# EAGLE schematic Payload_Electronics (EAGLE 9.0.1)
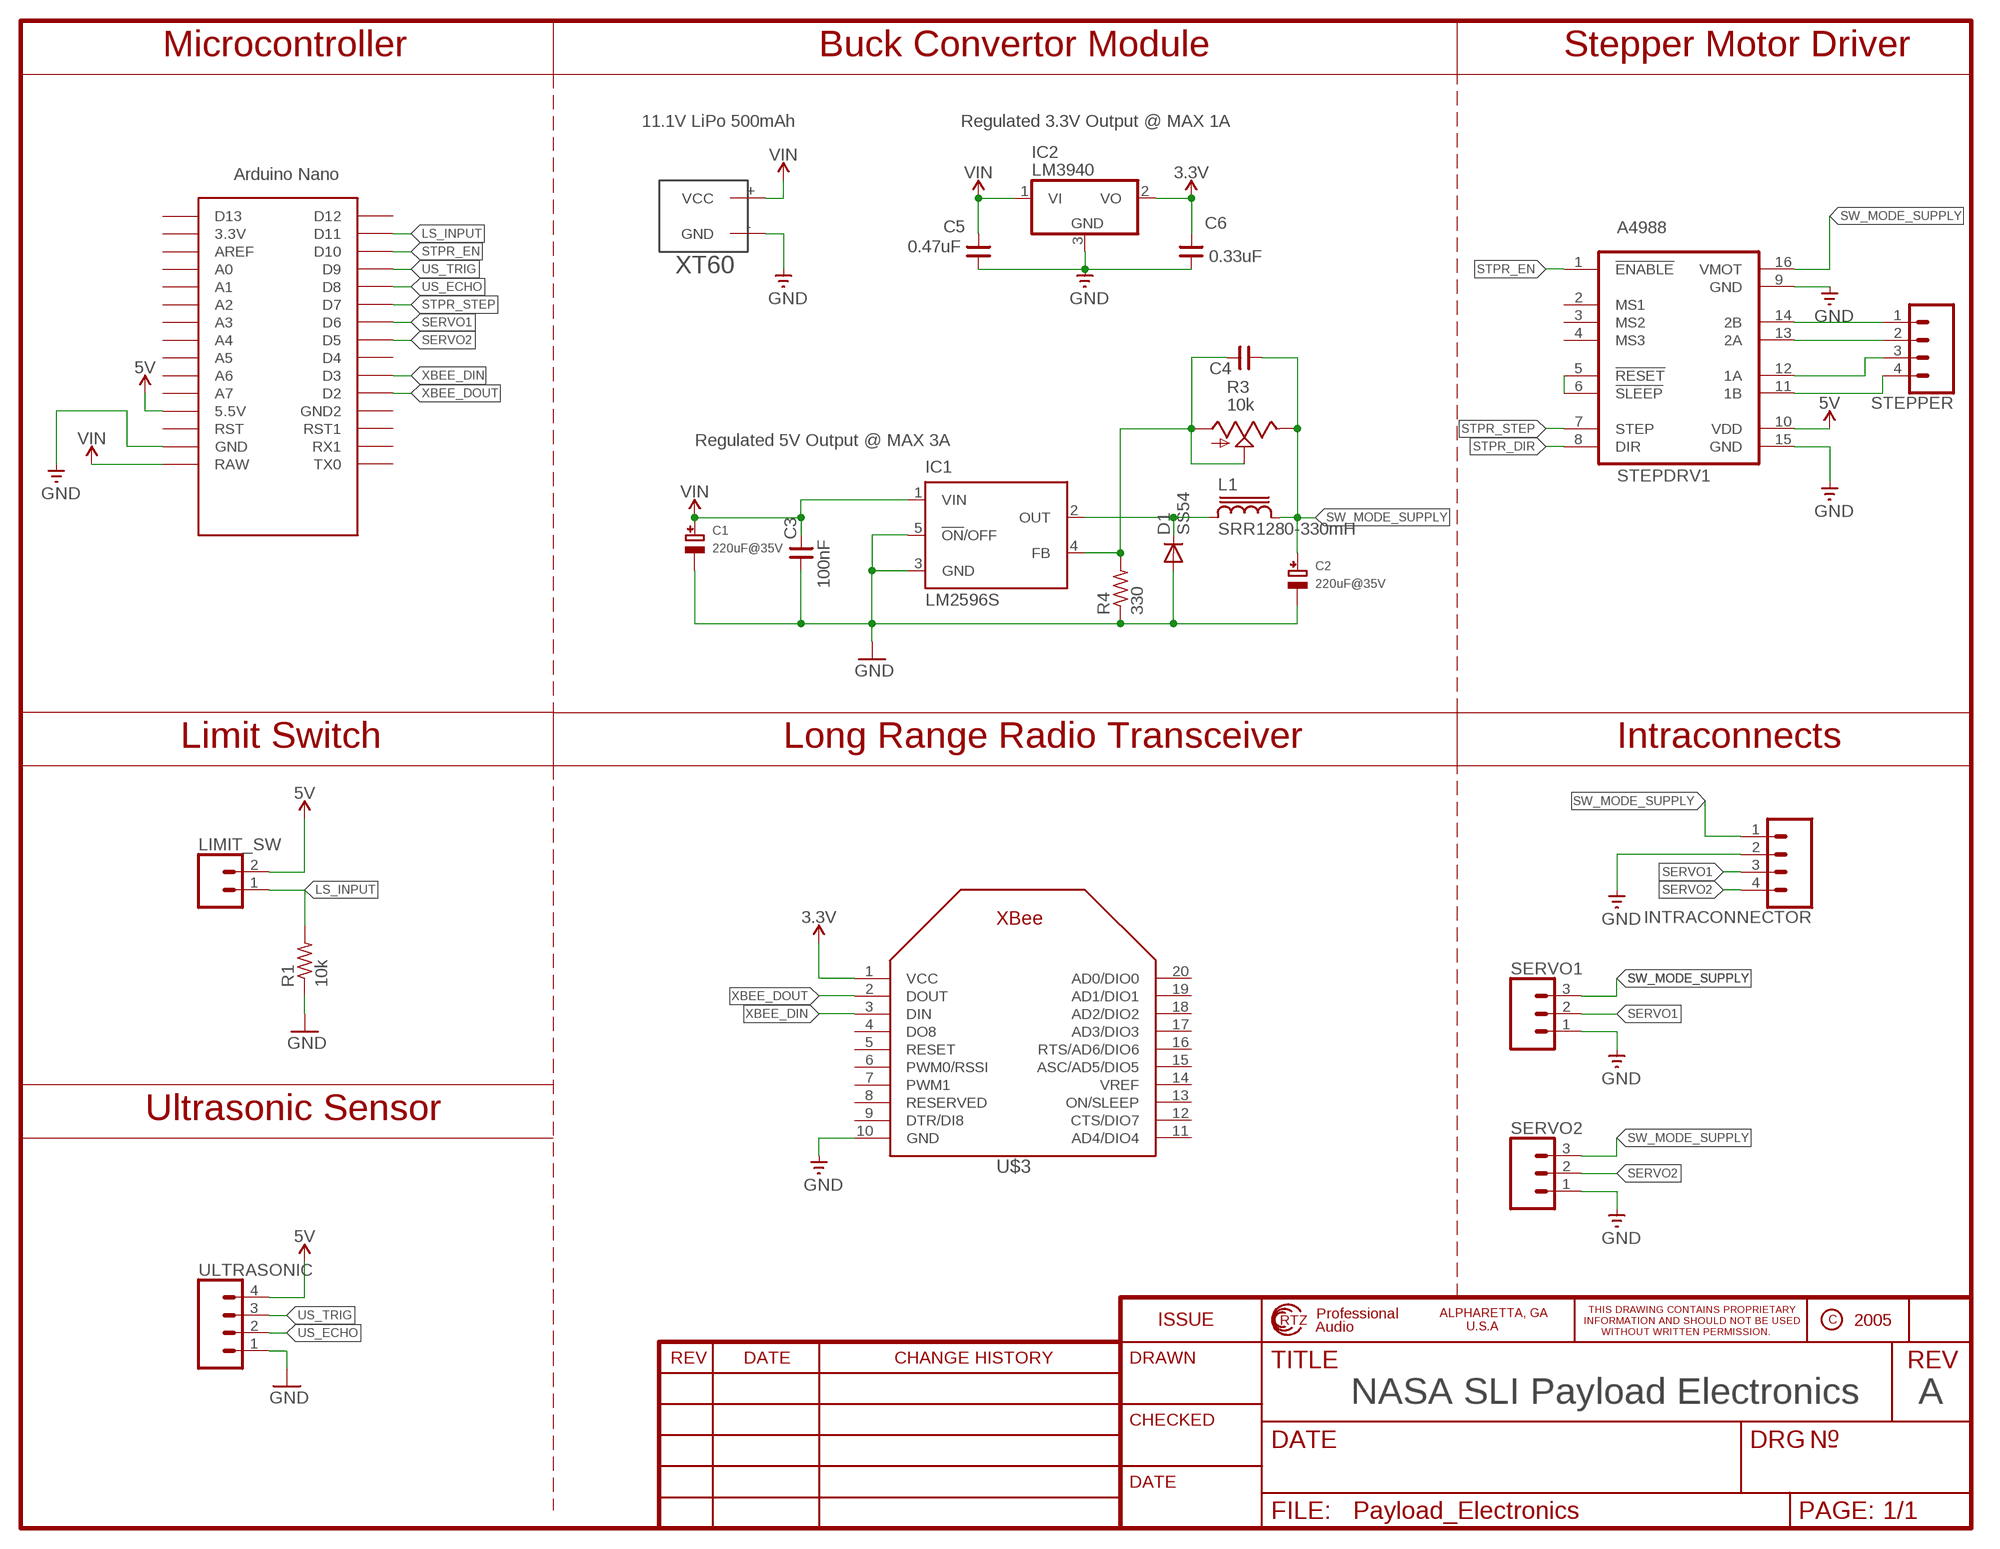
[diagram p0: schematic, sheet 1]

## Parts
C1  220uF@35V  CAP_ELECTROLYTICPANASONIC_D  [PANASONIC_D]
C2  220uF@35V  CAP_ELECTROLYTICPANASONIC_D  [PANASONIC_D]
C3  100nF  CNP-0603  [0603]
C4  CNP-0603  [0603]
C5  0.47uF  CNP-0805  [0805]
C6  0.33uF  CNP-0805  [0805]
D1  SS54  S3G  [DO214AB]
IC1  LM2596S  [TO263-5]
IC2  LM3940  7815DT  [TO252]
INTRACONNECTOR  CONN_04  [1X04]
L1  SRR1280-330mH  SRR1280  [SRR1280]
LIMIT_SW  CONN_02  [1X02]
R1  10k  R-US_M0805  [M0805]
R3  10k  TRIM_US-S64W  [S64W]
R4  330  R-US_R0603  [R0603]
SERVO1  CONN_03  [1X03]
SERVO2  CONN_03  [1X03]
STEPDRV1  A4988  POLOLULU2128  [POLOLULU2128]
STEPPER  CONN_04  [1X04]
U$1  NANO  [NANO]
U$2  XT60  [XT60]
U$3  XBEE  [XBEE]
ULTRASONIC  CONN_04  [1X04]

## Nets
3.3V: C6.2 IC2.2(VO) U$3.1(VCC)
5V: LIMIT_SW.2 STEPDRV1.10(VDD) U$1.5V(5.5V) ULTRASONIC.4
GND: C1.- C2.- C3.1 C5.1 C6.1 D1.A IC1.3(GND) IC1.5(!ON!/OFF) IC2.3(GND) INTRACONNECTOR.2 R1.1 R4.1 SERVO1.1 SERVO2.1 STEPDRV1.9(GND) STEPDRV1.15(GND) U$1.GND U$2.-(GND) U$3.10(GND) ULTRASONIC.1
LS_INPUT: LIMIT_SW.1 R1.2 U$1.D11
N$2: STEPDRV1.5(!RESET) STEPDRV1.6(!SLEEP)
N$3: D1.C IC1.2(OUT) L1.1
N$4: C4.2 IC1.4(FB) R3.A R3.S R4.2
N$9: STEPDRV1.11(1B) STEPPER.4
N$10: STEPDRV1.12(1A) STEPPER.3
N$11: STEPDRV1.13(2A) STEPPER.2
N$12: STEPDRV1.14(2B) STEPPER.1
SERVO1: INTRACONNECTOR.3 SERVO1.2 U$1.D6
SERVO2: INTRACONNECTOR.4 SERVO2.2 U$1.D5
STPR_DIR: STEPDRV1.8(DIR)
STPR_EN: STEPDRV1.1(!ENABLE) U$1.D10
STPR_STEP: STEPDRV1.7(STEP) U$1.D7
SW_MODE_SUPPLY: C2.+ C4.1 INTRACONNECTOR.1 L1.2 R3.E SERVO1.3 SERVO2.3 STEPDRV1.16(VMOT)
US_ECHO: U$1.D8 ULTRASONIC.2
US_TRIG: U$1.D9 ULTRASONIC.3
VIN: C1.+ C3.2 C5.2 IC1.1(VIN) IC2.1(VI) U$1.RAW U$2.+(VCC)
XBEE_DIN: U$1.D3 U$3.3(DIN)
XBEE_DOUT: U$1.D2 U$3.2(DOUT)
Unconnected: STEPDRV1.2(MS1) STEPDRV1.3(MS2) STEPDRV1.4(MS3) U$1.3.3V U$1.A0 U$1.A1 U$1.A2 U$1.A3 U$1.A4 U$1.A5 U$1.A6 U$1.A7 U$1.AREF U$1.D4 U$1.D12 U$1.D13 U$1.GND1(GND2) U$1.ICSP1 U$1.ICSP2 U$1.ICSP3 U$1.ICSP4 U$1.ICSP5 U$1.ICSP6 U$1.RST U$1.RST1 U$1.RX1 U$1.TX0 U$3.4(DO8) U$3.5(RESET) U$3.6(PWM0/RSSI) U$3.7(PWM1) U$3.8(RESERVED) U$3.9(DTR/DI8) U$3.11(AD4/DIO4) U$3.12(CTS/DIO7) U$3.13(ON/SLEEP) U$3.14(VREF) U$3.15(ASC/AD5/DIO5) U$3.16(RTS/AD6/DIO6) U$3.17(AD3/DIO3) U$3.18(AD2/DIO2) U$3.19(AD1/DIO1) U$3.20(AD0/DIO0)

## Notes on the sheet
- Microcontroller | Buck Convertor Module | Stepper Motor Driver
- 11.1V LiPo 500mAh | Regulated 3.3V Output @ MAX 1A
- Regulated 5V Output @ MAX 3A
- Limit Switch | Long Range Radio Transceiver | Intraconnects
- Ultrasonic Sensor
- NASA SLI Payload Electronics | A

## Library data of the parts
C1 C2 = microbuilder:CAP_ELECTROLYTIC: Electrolytic Capacitors PANASONIC_C - Size C Panasonic Electrolytic Aluminum Capacitor 47µF 16V 20% Electrolytic Capacitor [Digikey: PCE3890TR-ND] PANASONIC_D - Size D Panasonic Electrolytic Aluminum Capacitor 100µF 25V 20% Electrolytic Capacitor [Digikey: PCE3898TR-ND]
C3-C6 = cap-master:CNP-: NON-POLARIZED CAP
D1 = s3x_10:S3*: S3A - S3N General Purpose Rectifiers Source: http://www.fairchildsemi.com/datasheets/S3/S3A.pdf; MF: Fairchild; MPN: S3G; OC_FARNELL: 2454094; OC_NEWARK: 58K2397
IC1 = national-semiconductor:LM2596: SIMPLE SWITCHER® Power Converter 150 kHz 3A Step-Down Voltage Regulator Source: http://www.national.com/ds/LM/LM2596.pdf; MF: NATIONAL SEMICONDUCTOR; MPN: LM2596S-ADJ/NOPB; OC_FARNELL: 9494367; OC_NEWARK: 41K3842
IC2 = adafruit:78*: Positive VOLTAGE REGULATOR Added bigger pads to the TO-92 package
INTRACONNECTOR STEPPER ULTRASONIC = SparkFun-Connectors:CONN_04: Multi connection point. Often used as Generic Header-pin footprint for 0.1 inch spaced/style header connections On any of the 0.1 inch spaced packages, you can populate with these: Break Away Headers - Straight <https://www.sparkfun.com/products/116> (PRT-00116) Break Away Male Headers - Right Angle <https://www.sparkfun.com/products/553> (PRT-00553) Female Headers <https://www.sparkfun.com/products/115> (PRT-00115) Break Away Headers - Machine Pin <https://www.sparkfun.com/products/117> (PRT-00117) Break Away Female Headers - Swiss Machine Pin <https://www.sparkfun.com/products/743> (PRT-00743) For SCREWTERMINALS and SPRING TERMINALS visit here: Screw Terimnals on SparkFun.com <https://www.sparkfun.com/search/results?term=Screw+Terminals> (5mm/3.5mm/2.54mm spacing) This device is also useful as a general connection point to wire up your design to another part of your project. Our various solder wires solder well into these plated through hole pads. Hook-Up Wire - Assortment (Stranded, 22 AWG) <https://www.sparkfun.com/products/11375> (PRT-11375) Hook-Up Wire - Assortment (Solid Core, 22 AWG) <https://www.sparkfun.com/products/11367> (PRT-11367) View the entire wire category on our website here <https://www.sparkfun.com/categories/141> Special notes: Molex polarized connector foot print use with SKU : PRT-08231 with associated crimp pins and housings. 1MM SMD Version SKU: PRT-10208; PROD_ID: CONN-09696
L1 = inductor-bourns:SRR1280: POWER INDUCTOR
LIMIT_SW = SparkFun-Connectors:CONN_02: Multi connection point. Often used as Generic Header-pin footprint for 0.1 inch spaced/style header connections On any of the 0.1 inch spaced packages, you can populate with these: Break Away Headers - Straight <https://www.sparkfun.com/products/116> (PRT-00116) Break Away Male Headers - Right Angle <https://www.sparkfun.com/products/553> (PRT-00553) Female Headers <https://www.sparkfun.com/products/115> (PRT-00115) Break Away Headers - Machine Pin <https://www.sparkfun.com/products/117> (PRT-00117) Break Away Female Headers - Swiss Machine Pin <https://www.sparkfun.com/products/743> (PRT-00743) For SCREWTERMINALS and SPRING TERMINALS visit here: Screw Terimnals on SparkFun.com <https://www.sparkfun.com/search/results?term=Screw+Terminals> (5mm/3.5mm/2.54mm spacing) This device is also useful as a general connection point to wire up your design to another part of your project. Our various solder wires solder well into these plated through hole pads. Hook-Up Wire - Assortment (Stranded, 22 AWG) <https://www.sparkfun.com/products/11375> (PRT-11375) Hook-Up Wire - Assortment (Solid Core, 22 AWG) <https://www.sparkfun.com/products/11367> (PRT-11367) View the entire wire category on our website here <https://www.sparkfun.com/categories/141> Special notes: Molex polarized connector foot print use with: PRT-08233 with associated crimp pins and housings. 2.54_SCREWTERM for use with PRT-10571. 3.5mm Screw Terminal footprints for PRT-08084 5mm Screw Terminal footprints for use with PRT-08432
R1 R4 = adafruit:R-US_: RESISTOR, American symbol
R3 = pot:TRIM_US-: POTENTIOMETER
SERVO1 SERVO2 = SparkFun-Connectors:CONN_03: Multi connection point. Often used as Generic Header-pin footprint for 0.1 inch spaced/style header connections On any of the 0.1 inch spaced packages, you can populate with these: Break Away Headers - Straight <https://www.sparkfun.com/products/116> (PRT-00116) Break Away Male Headers - Right Angle <https://www.sparkfun.com/products/553> (PRT-00553) Female Headers <https://www.sparkfun.com/products/115> (PRT-00115) Break Away Headers - Machine Pin <https://www.sparkfun.com/products/117> (PRT-00117) Break Away Female Headers - Swiss Machine Pin <https://www.sparkfun.com/products/743> (PRT-00743) Stackable Header - 3 Pin (Female, 0.1") <https://www.sparkfun.com/products/13875> (PRT-13875) For SCREWTERMINALS and SPRING TERMINALS visit here: Screw Terimnals on SparkFun.com <https://www.sparkfun.com/search/results?term=Screw+Terminals> (5mm/3.5mm/2.54mm spacing) This device is also useful as a general connection point to wire up your design to another part of your project. Our various solder wires solder well into these plated through hole pads. Hook-Up Wire - Assortment (Stranded, 22 AWG) <https://www.sparkfun.com/products/11375> (PRT-11375) Hook-Up Wire - Assortment (Solid Core, 22 AWG) <https://www.sparkfun.com/products/11367> (PRT-11367) View the entire wire category on our website here <https://www.sparkfun.com/categories/141> Special notes: Molex polarized connector foot print use with SKU : PRT-08232 with associated crimp pins and housings.
STEPDRV1 = stepper_drivers_etc:POLOLULU2128
U$1 = Arduino-clone:NANO: Arduino Nano
U$2 = XT60:XT60: XT60
U$3 = adafruit:XBEE